# EAGLE design counter (EAGLE 5.12)
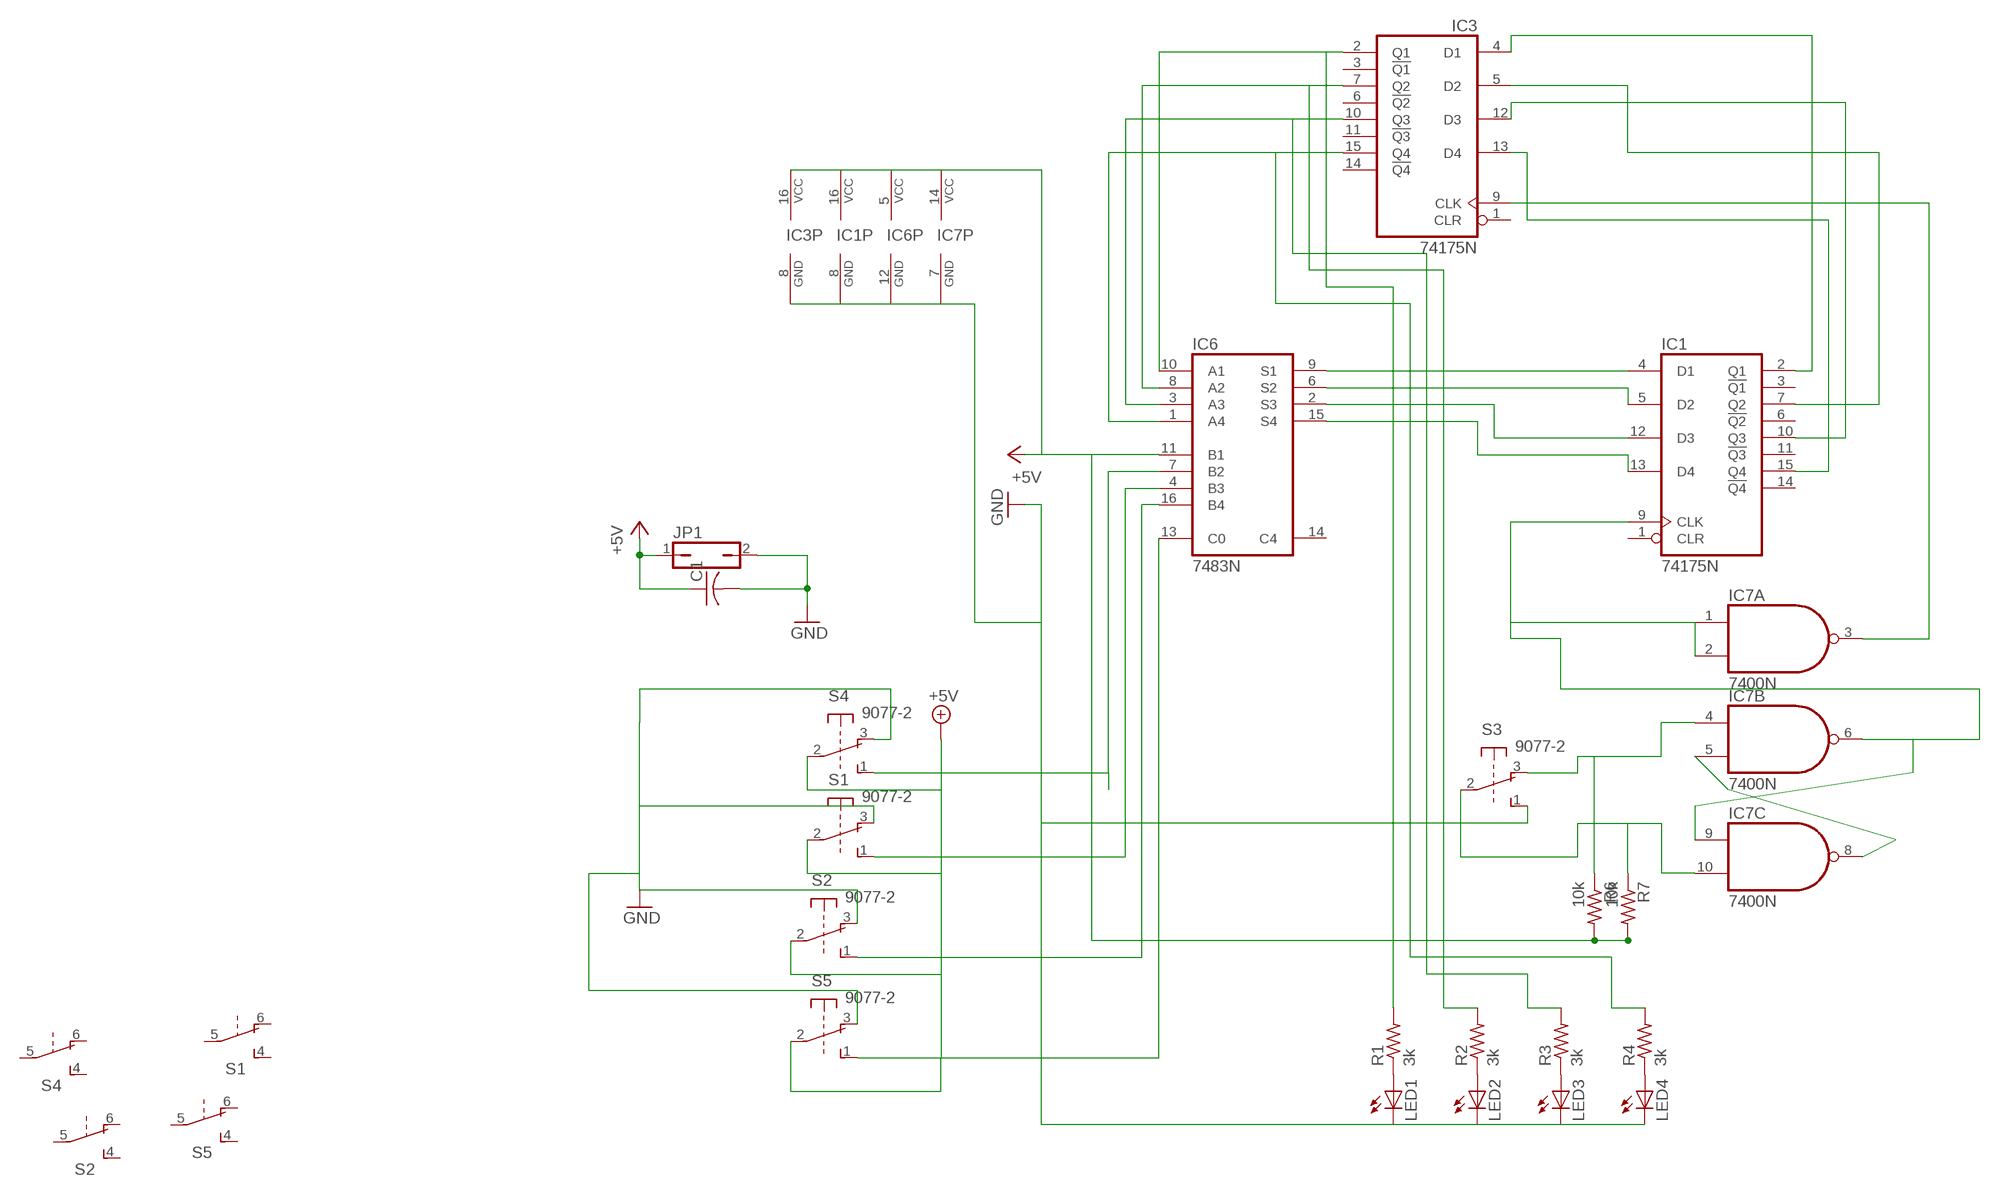
[diagram p0: schematic, sheet 1]

## Parts
C1  C-USC0805  [C0805]
IC1  74175N  [DIL16]
IC3  74175N  [DIL16]
IC6  7483N  [DIL16]
IC7  7400N  [DIL14]
JP1  JP1Q  [JP1]
LED1  LED3MM  [LED3MM]
LED2  LED3MM  [LED3MM]
LED3  LED3MM  [LED3MM]
LED4  LED3MM  [LED3MM]
R1  3k  R-US_R0805  [R0805]
R2  3k  R-US_R0805  [R0805]
R3  3k  R-US_R0805  [R0805]
R4  3k  R-US_R0805  [R0805]
R6  10k  R-US_R0805  [R0805]
R7  10k  R-US_R0805  [R0805]
S1  9077-2  [9077-2]
S2  9077-2  [9077-2]
S3  9077-2  [9077-2]
S4  9077-2  [9077-2]
S5  9077-2  [9077-2]

## Nets
+5V: C1.1 IC1.16(VCC) IC3.16(VCC) IC6.5(VCC) IC6.11(B1) IC7.14(P:VCC) JP1.1 R6.2 R7.2 S1.2(1:P) S2.2(1:P) S4.2(1:P) S5.2(1:P)
GND: C1.2 IC3.8(GND) IC6.12(GND) IC7.7(P:GND) JP1.2 LED4.K(C) S1.3(1:O) S2.3(1:O) S3.1(1:S) S4.3(1:O) S5.3(1:O)
N$1: IC1.12(D3) IC6.2(S3)
N$2: IC1.5(D2) IC6.6(S2)
N$3: IC1.13(D4) IC6.15(S4)
N$4: IC1.4(D1) IC6.9(S1)
N$5: IC3.7(Q2) IC6.8(A2) R2.2
N$6: IC3.10(Q3) IC6.3(A3) R3.2
N$7: IC3.15(Q4) IC6.1(A4) R4.2
N$8: IC6.7(B2) S4.1(1:S)
N$9: IC3.2(Q1) IC6.10(A1) R1.2
N$10: IC6.4(B3) S1.1(1:S)
N$11: IC6.13(C0) S5.1(1:S)
N$12: IC6.16(B4) S2.1(1:S)
N$13: LED4.A R4.1
N$14: LED2.A R2.1
N$15: IC1.2(Q1) IC3.4(D1)
N$16: IC1.7(Q2) IC3.5(D2)
N$17: IC3.9(CLK) IC7.3(A:O)
N$18: LED1.A R1.1
N$19: LED3.A R3.1
N$20: IC1.9(CLK) IC7.1(A:I0) IC7.2(A:I1) IC7.6(B:O) IC7.9(C:I0)
N$21: IC7.5(B:I1) IC7.8(C:O)
N$22: IC7.4(B:I0) R6.1 S3.3(1:O)
N$23: IC7.10(C:I1) R7.1 S3.2(1:P)
N$24: IC1.10(Q3) IC3.12(D3)
N$25: IC1.15(Q4) IC3.13(D4)
Unconnected: IC1.1(CLR) IC1.3(!Q1) IC1.6(!Q2) IC1.11(!Q3) IC1.14(!Q4) IC3.1(CLR) IC3.3(!Q1) IC3.6(!Q2) IC3.11(!Q3) IC3.14(!Q4) IC6.14(C4) IC7.11(D:O) IC7.12(D:I0) IC7.13(D:I1) LED1.K(C) LED2.K(C) LED3.K(C) S1.4(2:S) S1.5(2:P) S1.6(2:O) S2.4(2:S) S2.5(2:P) S2.6(2:O) S3.4(2:S) S3.5(2:P) S3.6(2:O) S4.4(2:S) S4.5(2:P) S4.6(2:O) S5.4(2:S) S5.5(2:P) S5.6(2:O)

## Power pins joined to a net without a drawn wire
GND: IC1.8(GND)

## Library data of the parts
C1 = rcl:C-US: CAPACITOR, American symbol
IC1 IC3 = 74xx-us:74*175: Qadruple D type FLIP FLOP, clear
IC6 = 74xx-us:74*83: 4-bit binary full ADDER, fast carry
IC7 = 74xx-us:74*00: Quad 2-input NAND gate
JP1 = jumper:JP1Q: JUMPER
LED1-LED4 = led:LED: LED OSRAM: - CHIPLED LG R971, LG N971, LY N971, LG Q971, LY Q971, LO R971, LY R971 LH N974, LH R974 LS Q976, LO Q976, LY Q976 LO Q996 - Hyper CHIPLED LW Q18S LB Q993, LB Q99A, LB R99A - SideLED LS A670, LO A670, LY A670, LG A670, LP A670 LB A673, LV A673, LT A673, LW A673 LH A674 LY A675 LS A676, LA A676, LO A676, LY A676, LW A676 LS A679, LY A679, LG A679 - Hyper Micro SIDELED® LS Y876, LA Y876, LO Y876, LY Y876 LT Y87S - SmartLED LW L88C, LW L88S LB L89C, LB L89S, LG L890 LS L89K, LO L89K, LY L89K LS L896, LA L896, LO L896, LY L896 - TOPLED LS T670, LO T670, LY T670, LG T670, LP T670 LSG T670, LSP T670, LSY T670, LOP T670, LYG T670 LG T671, LOG T671, LSG T671 LB T673, LV T673, LT T673, LW T673 LH T674 LS T676, LA T676, LO T676, LY T676, LB T676, LH T676, LSB T676, LW T676 LB T67C, LV T67C, LT T67C, LS T67K, LO T67K, LY T67K, LW E67C LS E67B, LA E67B, LO E67B, LY E67B, LB E67C, LV E67C, LT E67C LW T67C LS T679, LY T679, LG T679 LS T770, LO T770, LY T770, LG T770, LP T770 LB T773, LV T773, LT T773, LW T773 LH T774 LS E675, LA E675, LY E675, LS T675 LS T776, LA T776, LO T776, LY T776, LB T776 LHGB T686 LT T68C, LB T68C - Hyper Mini TOPLED® LB M676 - Mini TOPLED Santana® LG M470 LS M47K, LO M47K, LY M47K Source: http://www.osram.convergy.de LUXEON: - LUMILED® LXK2-PW12-R00, LXK2-PW12-S00, LXK2-PW14-U00, LXK2-PW14-V00 LXK2-PM12-R00, LXK2-PM12-S00, LXK2-PM14-U00 LXK2-PE12-Q00, LXK2-PE12-R00, LXK2-PE12-S00, LXK2-PE14-T00, LXK2-PE14-U00 LXK2-PB12-K00, LXK2-PB12-L00, LXK2-PB12-M00, LXK2-PB14-N00, LXK2-PB14-P00, LXK2-PB14-Q00 LXK2-PR12-L00, LXK2-PR12-M00, LXK2-PR14-Q00, LXK2-PR14-R00 LXK2-PD12-Q00, LXK2-PD12-R00, LXK2-PD12-S00 LXK2-PH12-R00, LXK2-PH12-S00 LXK2-PL12-P00, LXK2-PL12-Q00, LXK2-PL12-R00 Source: www.luxeon.com KINGBRIGHT: KA-3528ASYC Source: www.kingbright.com
R1-R4 R6 R7 = rcl:R-US_: RESISTOR, American symbol
S1-S5 = switch-misc:9077-2: MARQUARDT SWITCH 9077.0200 Distributor: Buerklin <https://www.buerklin.com/default.asp?event=ShowArtikel%2812G2822%29&l=d&jump=ArtNr_12G2822>

## Board
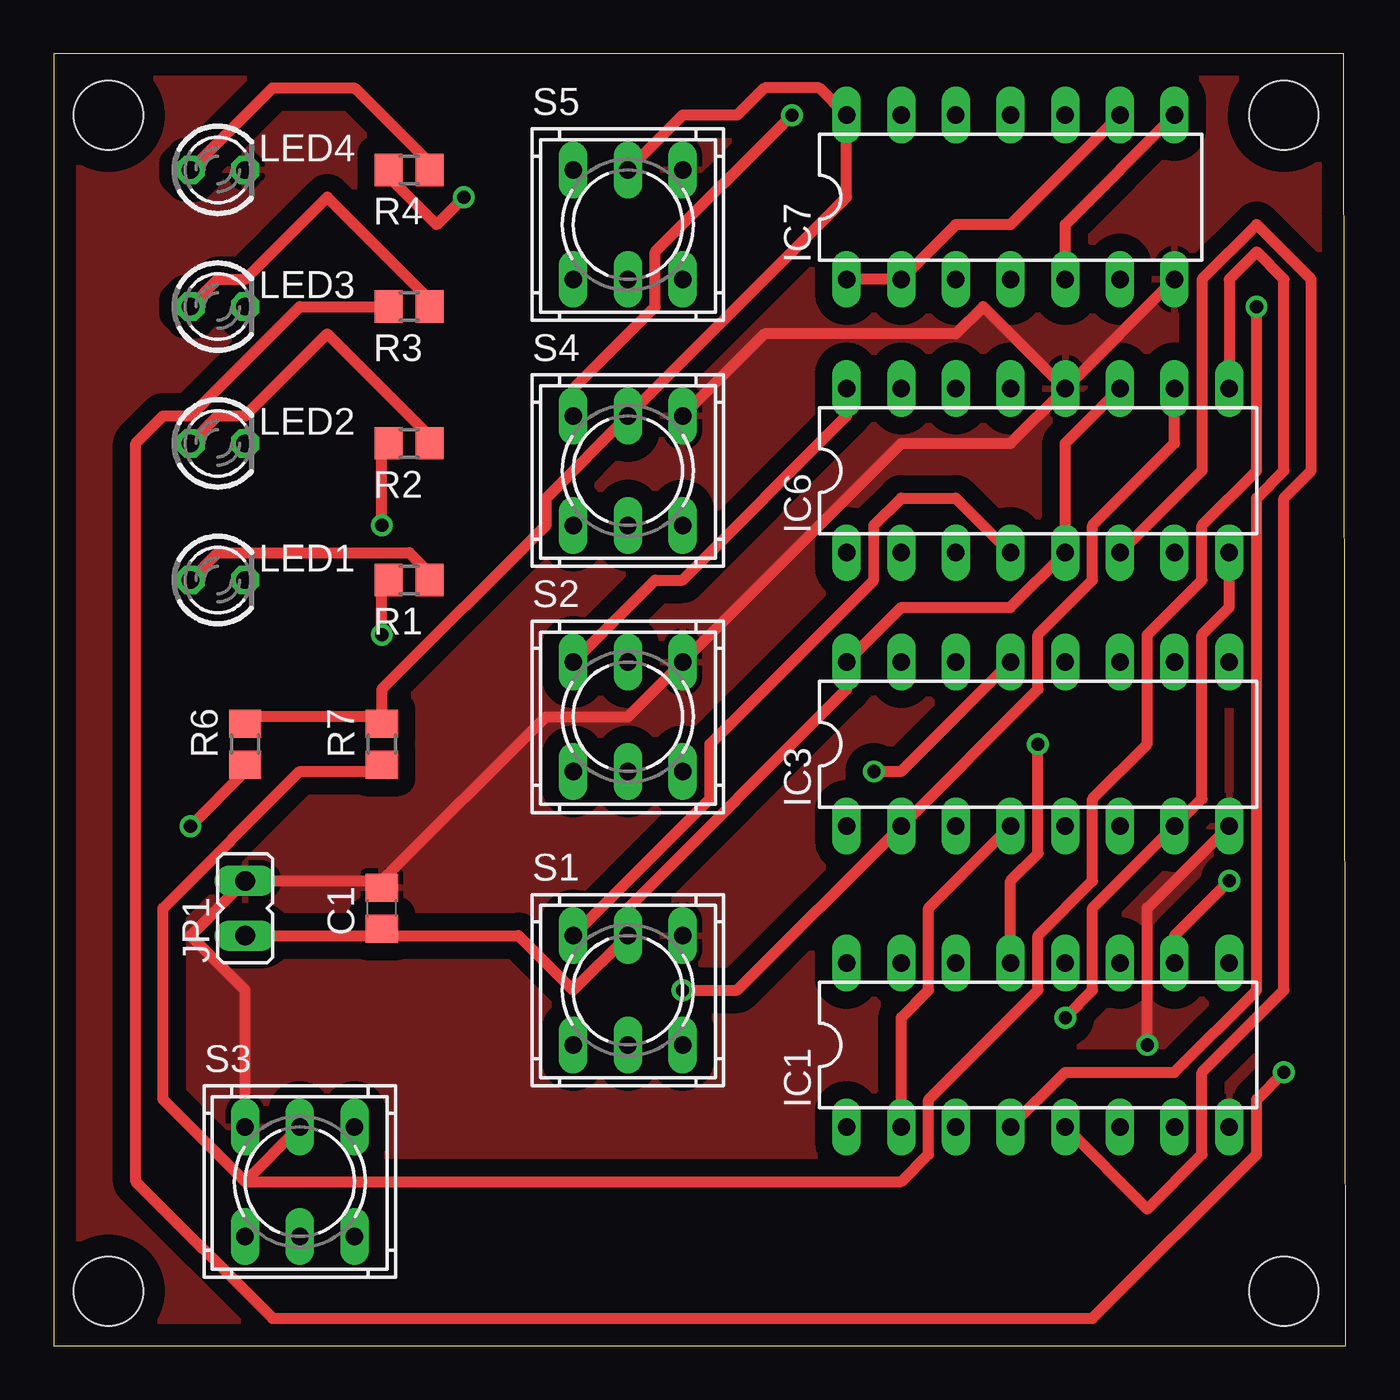
[diagram p1: board, top side]
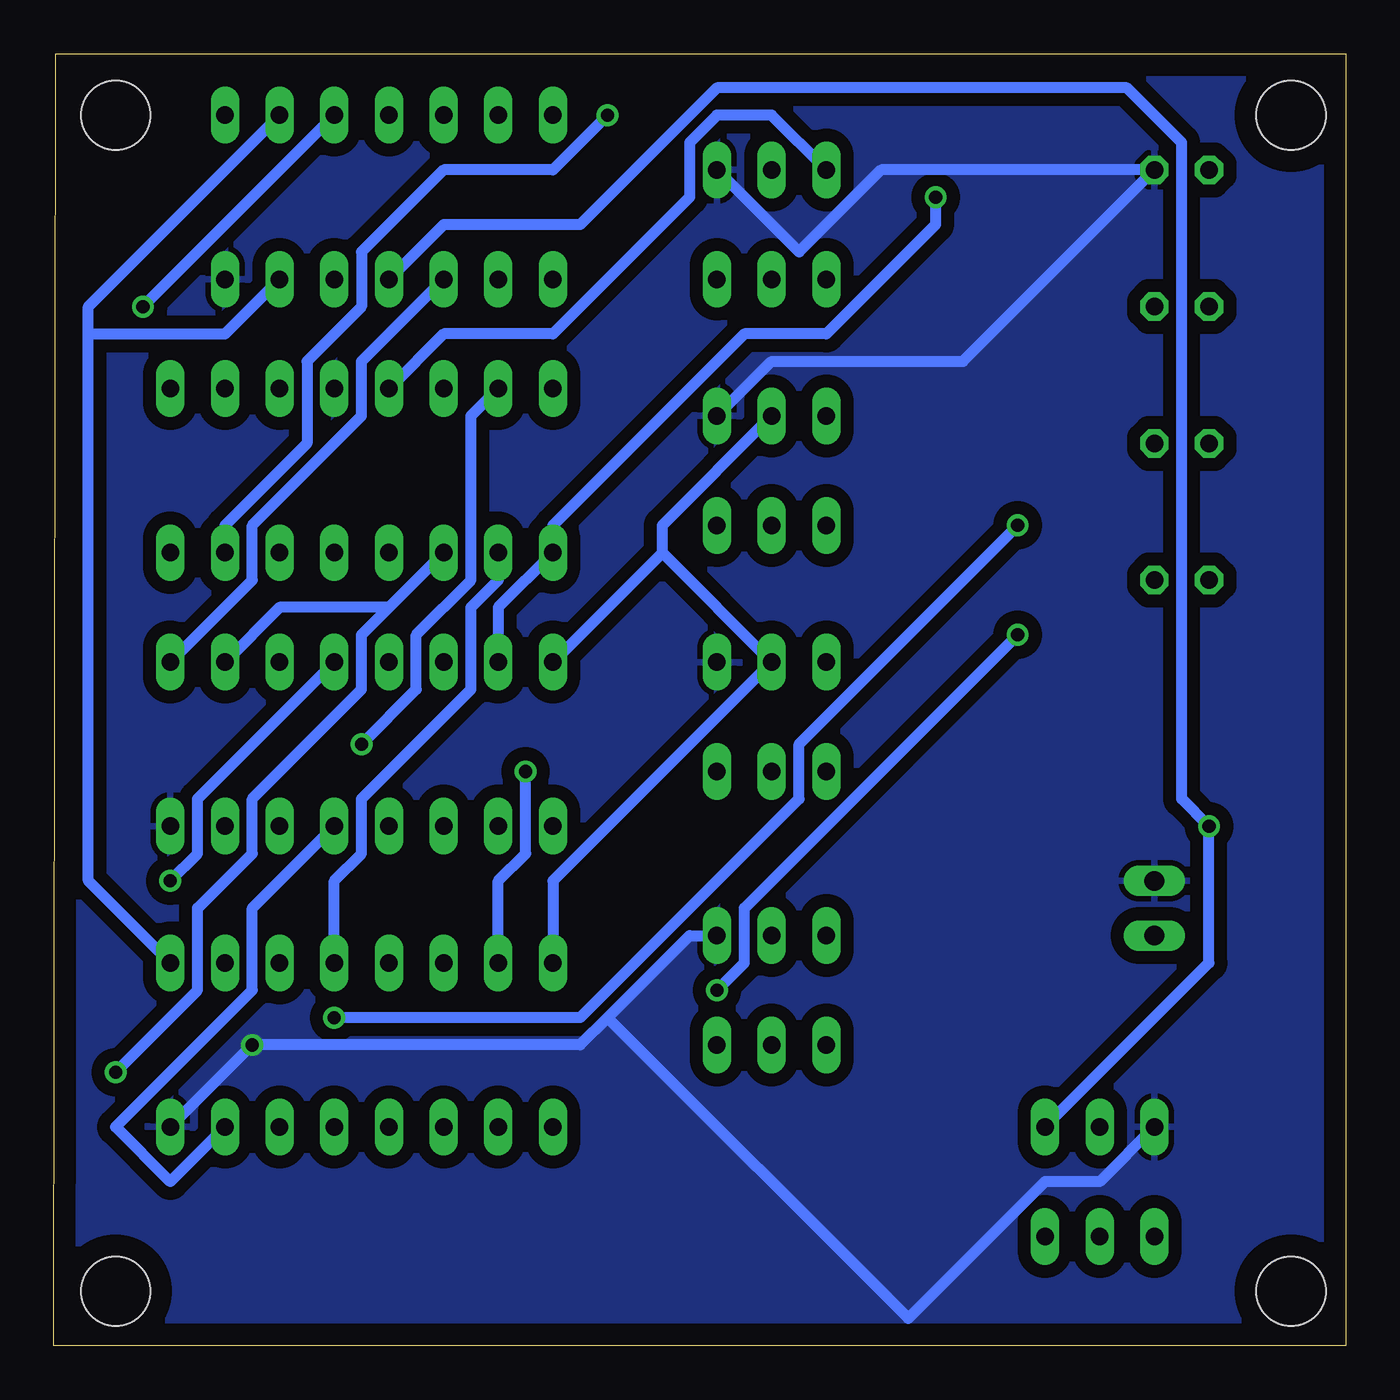
[diagram p2: board, bottom side, seen from below]

Size 60.02 x 60 mm. Coordinates in mm from the lower left corner, seen from the top.
Outline: 0,0 60.02,0 59.94,60 0,60 0,0
Copper layers (1*16): Top 0.035mm / dielectric 1.5mm / Bottom 0.035mm
Design rules "default *": minimum track width 0.5mm, minimum drill 24mil, track to track 8mil, track to pad 8mil, pad to pad 8mil, via to via 8mil, smd to smd 8mil, copper to edge 40mil, drill to drill 8mil, minimum pad ring 10mil, minimum via ring 8mil, stop-mask expansion 4mil, vias tented up to drill 0mil, thermal gap 10mil
Holes 3.2 mm at 2.54,2.54 57.15,2.54 57.15,57.15 2.54,57.15

### Footprints (pad centres in the part's own frame; a part is rotated, then mirrored left to right if it is on the bottom)
C0805 = smd 1.3 x 1.5: 1 -0.95,0; 2 0.95,0
DIL16 = drill 0.813 long: 1 -8.89,-3.81; 2 -6.35,-3.81; 3 -3.81,-3.81; 4 -1.27,-3.81; 5 1.27,-3.81; 6 3.81,-3.81; 7 6.35,-3.81; 8 8.89,-3.81; 9 8.89,3.81; 10 6.35,3.81; 11 3.81,3.81; 12 1.27,3.81; 13 -1.27,3.81; 14 -3.81,3.81; 15 -6.35,3.81; 16 -8.89,3.81
DIL14 = drill 0.813 long: 1 -7.62,-3.81; 2 -5.08,-3.81; 3 -2.54,-3.81; 4 0,-3.81; 5 2.54,-3.81; 6 5.08,-3.81; 7 7.62,-3.81; 8 7.62,3.81; 9 5.08,3.81; 10 2.54,3.81; 11 0,3.81; 12 -2.54,3.81; 13 -5.08,3.81; 14 -7.62,3.81
JP1 = drill 0.914 long: 1 0,-1.27; 2 0,1.27
LED3MM = drill 0.813 octagon: A -1.27,0; K 1.27,0
R0805 = smd 1.3 x 1.5: 1 -0.95,0; 2 0.95,0
9077-2 = drill 0.813 long: 1 -2.54,2.54; 2 0,2.54; 3 2.54,2.54; 4 -2.54,-2.54; 5 0,-2.54; 6 2.54,-2.54

### Placement (x,y rotation side)
C1  15.24,20.32 90 top
IC1  45.72,13.97 0 top
IC3  45.72,27.94 0 top
IC6  45.72,40.64 0 top
IC7  44.45,53.34 0 top
JP1  8.89,20.32 0 top
LED1  7.62,35.56 0 top
LED2  7.62,41.91 0 top
LED3  7.62,48.26 0 top
LED4  7.62,54.61 0 top
R1  16.51,35.56 180 top
R2  16.51,41.91 180 top
R3  16.51,48.26 180 top
R4  16.51,54.61 180 top
R6  8.89,27.94 90 top
R7  15.24,27.94 90 top
S1  26.67,16.51 0 top
S2  26.67,29.21 0 top
S3  11.43,7.62 0 top
S4  26.67,40.64 0 top
S5  26.67,52.07 0 top

### Tracks (layer width: path | path; a pad name or v marks a point on that pad's centre or on a via)
+5V
  Top 0.5: S5.2 29.21,57.15 31.75,57.15 33.02,58.42 35.56,58.42 IC7.14 36.83,53.34 S4.2 22.86,39.37 22.86,38.1 15.24,30.48 15.24,29.21 | IC6.11 46.99,41.91 IC6.5 44.45,34.29 39.37,34.29 IC3.16 36.83,30.48 26.67,20.32 S1.2 24.13,16.51 21.59,19.05 15.24,19.05 | JP1.1 15.24,19.05 | 15.24,29.21 8.89,29.21 R6.2 | 15.24,29.21 R7.2 | 15.24,19.05 C1.1
  Bottom 0.5: 31.75,36.83 S2.2 36.83,21.59 IC1.16 | IC3.16 31.75,36.83 | S4.2 31.75,38.1 31.75,36.83
GND  (via drill 0.61)
  Top 0.5: IC6.12 IC7.7 | IC6.12 43.18,48.26 41.91,46.99 33.02,46.99 S4.3 | IC3.8 50.8,20.32 v50.8,13.97 | 15.24,21.59 JP1.2 6.35,19.05 8.89,16.51 S3.1 | 15.24,21.59 22.86,29.21 26.67,29.21 S2.3 39.37,41.91 44.45,41.91 IC6.12 | 15.24,21.59 C1.2
  Bottom 0.5: S4.3 26.67,45.72 17.78,45.72 LED4.K 21.59,54.61 25.4,50.8 S5.3 | S1.3 30.48,19.05 34.29,15.24 | 34.29,15.24 35.56,13.97 v50.8,13.97 IC1.8 | 34.29,15.24 20.32,1.27 13.97,7.62 11.43,7.62 S3.1
  pour Top (isolate 0.813): 0,0 0,59.69 59.69,59.69 59.69,55.88 59.69,0
  pour Bottom (isolate 0.61): 0,0 0,59.69 59.69,59.69 59.69,57.15 59.69,0
N$1
  Bottom 0.5: IC1.12 46.99,21.59 45.72,22.86 45.72,25.4 40.64,30.48 40.64,34.29 39.37,35.56 IC6.2
N$2
  Top 0.5: IC1.5 50.8,6.35 53.34,8.89 53.34,12.7 57.15,16.51 57.15,39.37 58.42,40.64 58.42,49.53 55.88,52.07 53.34,49.53 53.34,40.64 IC6.6
N$3  (via drill 0.61)
  Top 0.5: IC1.13 44.45,21.59 45.72,22.86 v45.72,27.94
  Bottom 0.5: v45.72,27.94 43.18,30.48 43.18,33.02 40.64,35.56 40.64,43.18 IC6.15
N$4
  Top 0.5: IC1.4 46.99,12.7 52.07,12.7 55.88,16.51 55.88,39.37 57.15,40.64 57.15,49.53 55.88,50.8 54.61,49.53 IC6.9
N$5  (via drill 0.61)
  Top 0.5: v15.24,38.1 15.24,41.91 R2.2 | v46.99,15.24 48.26,16.51 48.26,20.32 IC3.7 53.34,25.4 53.34,33.02 54.61,34.29 IC6.8
  Bottom 0.5: v15.24,38.1 25.4,27.94 25.4,25.4 35.56,15.24 v46.99,15.24
N$6  (via drill 0.61)
  Top 0.5: v57.15,12.7 55.88,11.43 55.88,8.89 48.26,1.27 10.16,1.27 3.81,7.62 3.81,41.91 5.08,43.18 6.35,43.18 11.43,48.26 R3.2
  Bottom 0.5: v57.15,12.7 53.34,16.51 53.34,20.32 50.8,22.86 50.8,25.4 45.72,30.48 45.72,33.02 44.45,34.29 | 44.45,34.29 IC6.3 | IC3.10 49.53,34.29 44.45,34.29
N$7  (via drill 0.61)
  Top 0.5: v19.05,53.34 17.78,52.07 15.24,54.61 R4.2
  Bottom 0.5: v19.05,53.34 19.05,52.07 24.13,46.99 27.94,46.99 36.83,38.1 IC6.1 39.37,34.29 IC3.15
N$8  (via drill 0.61)
  Top 0.5: S4.1 24.13,44.45 27.94,48.26 27.94,50.8 v34.29,57.15
  Bottom 0.5: v34.29,57.15 36.83,54.61 41.91,54.61 45.72,50.8 45.72,48.26 48.26,45.72 48.26,41.91 52.07,38.1 IC6.7
N$9  (via drill 0.61)
  Top 0.5: v15.24,33.02 15.24,35.56 R1.2 | v29.21,16.51 31.75,16.51 IC3.2 45.72,30.48 45.72,33.02 48.26,35.56 48.26,38.1 52.07,41.91 IC6.10
  Bottom 0.5: v15.24,33.02 27.94,20.32 27.94,17.78 v29.21,16.51
N$10
  Top 0.5: S1.1 30.48,25.4 30.48,27.94 38.1,35.56 38.1,38.1 39.37,39.37 41.91,39.37 IC6.4
N$11
  Bottom 0.5: S5.1 26.67,57.15 29.21,57.15 30.48,55.88 30.48,53.34 36.83,46.99 41.91,46.99 IC6.13
N$12
  Top 0.5: S2.1 27.94,35.56 29.21,35.56 36.83,43.18 IC6.16
N$13
  Top 0.5: LED4.A 10.16,58.42 13.97,58.42 17.78,54.61 R4.1
N$14
  Top 0.5: LED2.A 7.62,43.18 8.89,43.18 12.7,46.99 17.78,41.91 R2.1
N$15
  Top 0.5: IC1.2 39.37,15.24 40.64,16.51 40.64,20.32 IC3.4
N$16
  Bottom 0.5: IC1.7 54.61,7.62 57.15,10.16 50.8,16.51 50.8,20.32 IC3.5
N$17
  Bottom 0.5: IC3.9 50.8,35.56 50.8,38.1 45.72,43.18 45.72,45.72 IC7.3
N$18
  Top 0.5: LED1.A 7.62,36.83 16.51,36.83 17.78,35.56 R1.1
N$19
  Top 0.5: LED3.A 7.62,49.53 8.89,49.53 12.7,53.34 17.78,48.26 R3.1
N$20
  Top 0.5: IC7.1 IC7.2 41.91,52.07 44.45,52.07 IC7.9
  Bottom 0.5: IC1.9 58.42,21.59 58.42,46.99 | 58.42,46.99 58.42,48.26 IC7.9 | IC7.6 52.07,46.99 58.42,46.99
N$21
  Top 0.5: IC7.5 46.99,52.07 IC7.8
N$22  (via drill 0.61)
  Top 0.5: v6.35,24.13 8.89,26.67 R6.1
  Bottom 0.5: S3.3 6.35,17.78 v6.35,24.13 7.62,25.4 7.62,55.88 10.16,58.42 29.21,58.42 35.56,52.07 41.91,52.07 IC7.4
N$23  (via drill 0.61)
  Top 0.5: 8.89,7.62 5.08,11.43 5.08,20.32 11.43,26.67 15.24,26.67 R7.1 | 8.89,7.62 S3.2 | v55.88,48.26 55.88,40.64 53.34,38.1 53.34,35.56 50.8,33.02 50.8,27.94 48.26,25.4 48.26,21.59 45.72,19.05 45.72,16.51 40.64,11.43 40.64,8.89 39.37,7.62 8.89,7.62
  Bottom 0.5: v55.88,48.26 IC7.10
N$24  (via drill 0.61)
  Top 0.5: IC1.10 52.07,19.05 v54.61,21.59
  Bottom 0.5: v54.61,21.59 53.34,22.86 53.34,25.4 IC3.12
N$25  (via drill 0.61)
  Top 0.5: v38.1,26.67 39.37,26.67 IC3.13
  Bottom 0.5: IC1.15 39.37,21.59 38.1,22.86 v38.1,26.67